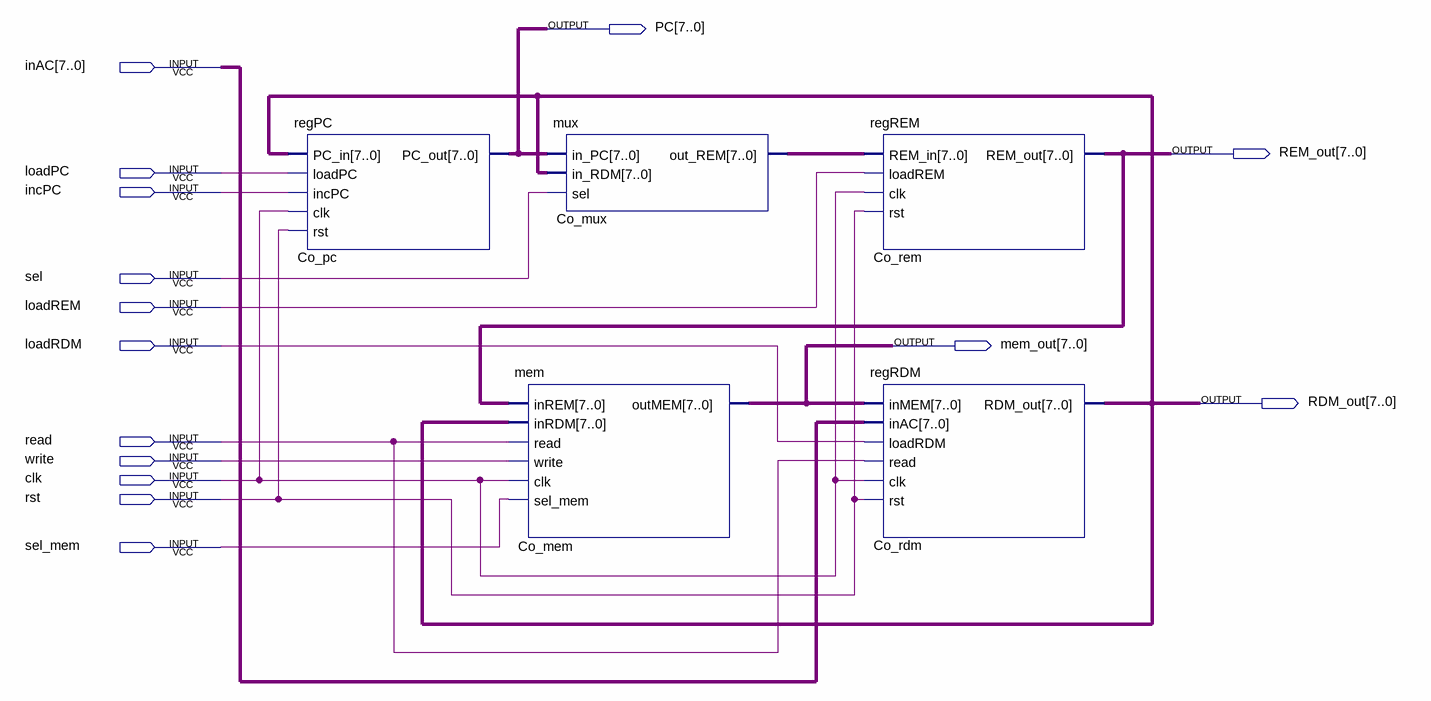
[diagram p0: schematic sheet]
// Quartus schematic test_mega_mem.bdf as structural Verilog: 5 symbols, 15 pins
module test_mega_mem (
  input  [7:0] inAC,
  input  loadPC,
  input  incPC,
  input  sel,
  input  loadREM,
  input  loadRDM,
  input  read,
  input  write,
  input  clk,
  input  rst,
  input  sel_mem,
  output [7:0] PC,
  output [7:0] REM_out,
  output [7:0] mem_out,
  output [7:0] RDM_out
);

  wire [7:0] Co_mux_out_rem;

  regPC Co_pc (.PC_in(RDM_out), .loadPC(loadPC), .incPC(incPC), .clk(clk), .rst(rst), .PC_out(PC));
  mux Co_mux (.in_PC(PC), .in_RDM(RDM_out), .sel(sel), .out_REM(Co_mux_out_rem));
  mem Co_mem (
    .inREM(REM_out), .inRDM(RDM_out), .read(read), .write(write), .clk(clk), .sel_mem(sel_mem),
    .outMEM(mem_out));
  regREM Co_rem (.REM_in(Co_mux_out_rem), .loadREM(loadREM), .clk(clk), .rst(rst), .REM_out(REM_out));
  regRDM Co_rdm (.inMEM(mem_out), .inAC(inAC), .loadRDM(loadRDM), .read(read), .clk(clk), .rst(rst), .RDM_out(RDM_out));
endmodule
